# Altium schematic sheet MCU.SchDoc: MCU
size A3; Date: 9/24/2014; Author: P.A.; CompanyName: STMicroelectronics; Organization: Microcontrollers Division; Address1: 12, Rue Jules HOROWITZ; Address2: 38019 Grenoble; Address3: FRANCE; DocumentNumber: MB1189; Revision: B-07; SheetNumber: 2; SheetTotal: 12; Project: STM32F469I-DISCO
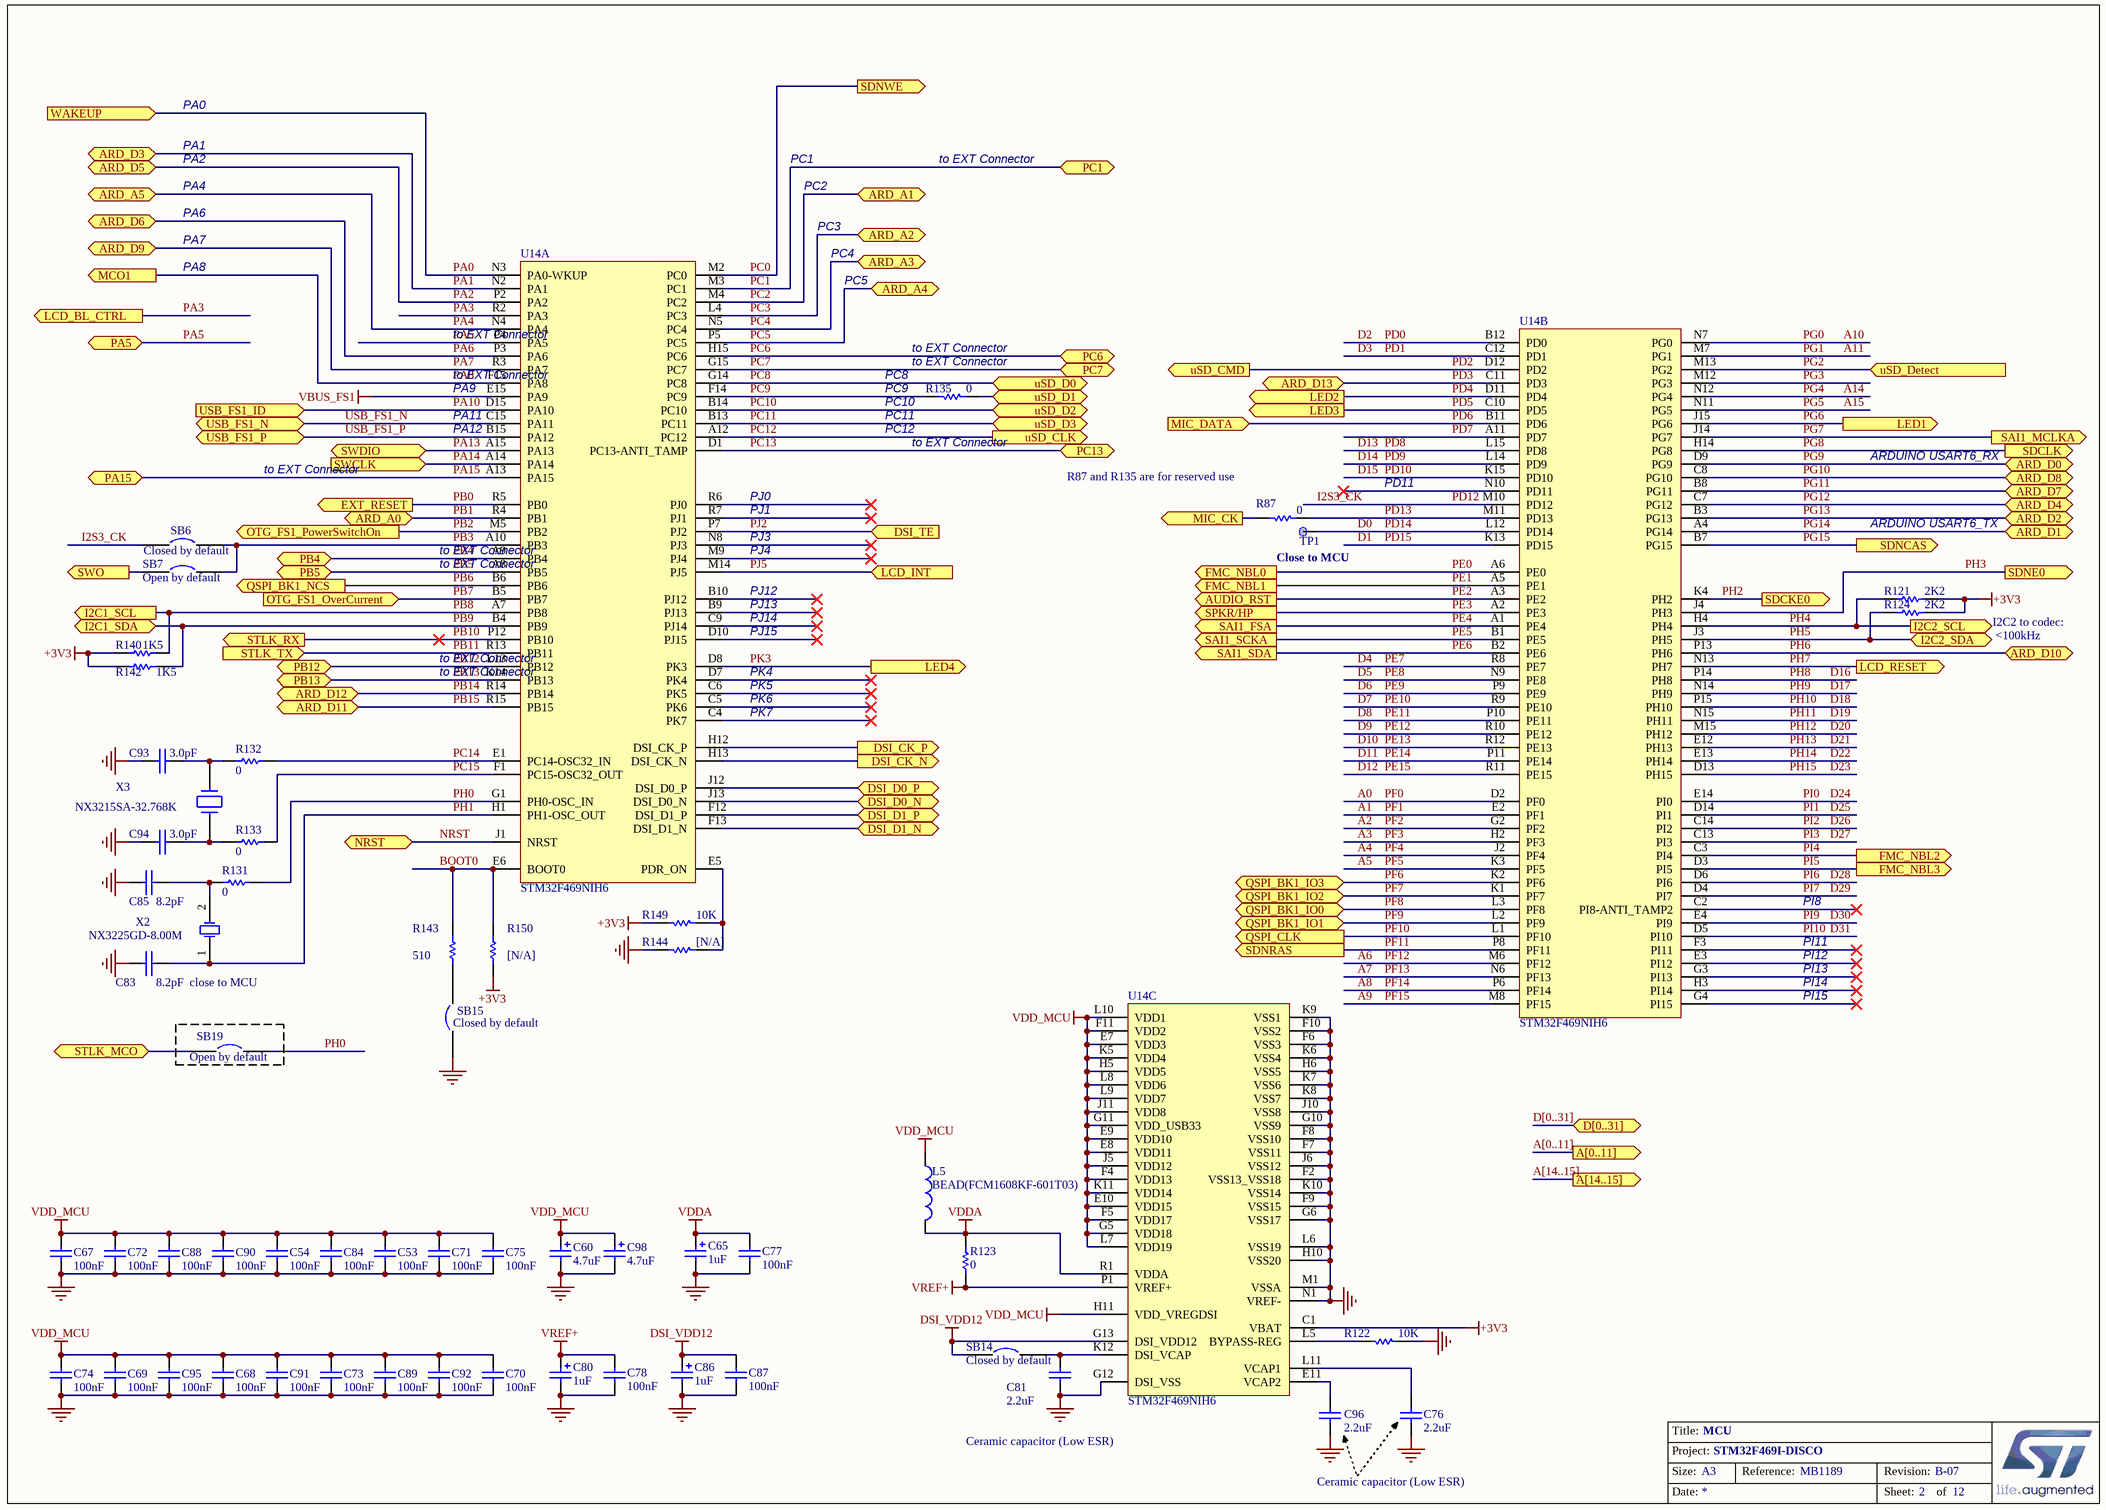
[diagram p0: MCU.SchDoc]

## Parts
C53  100nF  [0402C]
C54  100nF  [0402C]
C60  4.7uF  [TAN-A]
C65  1uF  [TAN-A]
C67  100nF  [0402C]
C68  100nF  [0402C]
C69  100nF  [0402C]
C70  100nF  [0402C]
C71  100nF  [0402C]
C72  100nF  [0402C]
C73  100nF  [0402C]
C74  100nF  [0402C]
C75  100nF  [0402C]
C76  2.2uF  [1206C]
C77  100nF  [0402C]
C78  100nF  [0402C]
C80  1uF  [TAN-A]
C81  2.2uF  [1206C]
C83  8.2pF  [0603C]
C84  100nF  [0402C]
C85  8.2pF  [0603C]
C86  1uF  [TAN-A]
C87  100nF  [0402C]
C88  100nF  [0402C]
C89  100nF  [0402C]
C90  100nF  [0402C]
C91  100nF  [0402C]
C92  100nF  [0402C]
C93  3.0pF  [0603C]
C94  3.0pF  [0603C]
C95  100nF  [0402C]
C96  2.2uF  [1206C]
C98  4.7uF  [TAN-A]
L5  BEAD(FCM1608KF-601T03)  [0603L]
R87  0  [0603R]
R121  2K2  [0603R]
R122  10K  [0402R]
R123  0  [0603R]
R124  2K2  [0603R]
R131  0  [0603R]
R132  0  [0603R]
R133  0  [0603R]
R135  0  [0603R]
R140  1K5  [0603R]
R142  1K5  [0603R]
R143  510  [0603R]
R144  [N/A]  [0603R]
R149  10K  [0402R]
R150  [N/A]  [0603R]
SB6  Closed by default  [SB_0603]
SB7  Open by default  [SB_0603]
SB14  Closed by default  [SB_0603]
SB15  Closed by default  [SB_0603]
SB19  Open by default  [SB_0603]
TP1  TP  [TP_C40]  (value not drawn)
U14  STM32F469NIH6  [BGA216_0R8_13X13]  (parts A,B,C of 3)
X2  NX3225GD-8.00M  [XTAL_2SM_3R2X2R5_H1]
X3  NX3215SA-32.768K  [XTAL_2SM_3R2X1R5]

## Ports
A[0..11] (out), A[14..15] (out), ARD_A0 (bidir), ARD_A1 (bidir), ARD_A2 (bidir), ARD_A3 (bidir), ARD_A4 (bidir), ARD_A5 (bidir), ARD_D0 (bidir), ARD_D1 (bidir), ARD_D2 (bidir), ARD_D3 (bidir), ARD_D4 (bidir), ARD_D5 (bidir), ARD_D6 (bidir), ARD_D7 (bidir), ARD_D8 (bidir), ARD_D9 (bidir), ARD_D10 (bidir), ARD_D11 (bidir), ARD_D12 (bidir), ARD_D13 (bidir), AUDIO_RST (out), D[0..31] (bidir), DSI_CK_N (out), DSI_CK_P (out), DSI_D0_N (bidir), DSI_D0_P (bidir), DSI_D1_N (bidir), DSI_D1_P (bidir), DSI_TE (in), EXT_RESET (out), FMC_NBL0 (out), FMC_NBL1 (out), FMC_NBL2 (out), FMC_NBL3 (out), I2C1_SCL (out), I2C1_SDA (bidir), I2C2_SCL (out), I2C2_SDA (bidir), LCD_BL_CTRL (out), LCD_INT (in), LCD_RESET (out), LED1 (out), LED2 (out), LED3 (out), LED4 (out), MCO1 (out), MIC_CK (out), MIC_DATA (in), NRST (bidir), OTG_FS1_OverCurrent (in), OTG_FS1_PowerSwitchOn (out), PA5 (bidir), PA15 (bidir), PB4 (bidir), PB5 (bidir), PB12 (bidir), PB13 (bidir), PC1 (bidir), PC6 (bidir), PC7 (bidir), PC13 (bidir), QSPI_BK1_IO0 (bidir), QSPI_BK1_IO1 (bidir), QSPI_BK1_IO2 (bidir), QSPI_BK1_IO3 (bidir), QSPI_BK1_NCS (out), QSPI_CLK (out), SAI1_FSA (out), SAI1_MCLKA (out), SAI1_SCKA (out), SAI1_SDA (out), SDCKE0 (out), SDCLK (out), SDNCAS (out), SDNE0 (out), SDNRAS (out), SDNWE (out), SPKR/HP (out), STLK_MCO, STLK_RX (out), STLK_TX (in), SWCLK (in), SWDIO, SWO (out), USB_FS1_ID (in), USB_FS1_N (bidir), USB_FS1_P (bidir), uSD_CLK (out), uSD_CMD (out), uSD_D0 (bidir), uSD_D1 (bidir), uSD_D2 (bidir), uSD_D3 (bidir), uSD_Detect (in), WAKEUP (in)

## Nets
+3V3: R121.1 R124.1 R140.1 R142.1 R149.2 R150.2 U14.C1(VBAT)
DSI_VDD12: C86.1 C87.2 SB14.1 U14.G13(DSI_VDD12)
GND: C53.2 C54.2 C60.2 C65.2 C67.2 C68.2 C69.2 C70.2 C71.2 C72.2 C73.2 C74.2 C75.2 C76.2 C77.1 C78.1 C80.2 C81.2 C83.2 C84.2 C85.2 C86.2 C87.1 C88.2 C89.2 C90.2 C91.2 C92.2 C93.2 C94.2 C95.2 C96.2 C98.2 R122.1 R144.2 SB15.1 U14.F2(VSS13_VSS18) U14.F6(VSS3) U14.F7(VSS11) U14.F8(VSS10) U14.F9(VSS15) U14.F10(VSS2) U14.G6(VSS17) U14.G10(VSS9) U14.G12(DSI_VSS) U14.H6(VSS5) U14.H10(VSS20) U14.J6(VSS12) U14.J10(VSS8) U14.K6(VSS4) U14.K7(VSS6) U14.K8(VSS7) U14.K9(VSS1) U14.K10(VSS14) U14.L6(VSS19) U14.M1(VSSA) U14.N1(VREF-)
VBUS_FS1: U14.E15(PA9)
VDD_MCU: C53.1 C54.1 C60.1 C67.1 C68.1 C69.1 C70.1 C71.1 C72.1 C73.1 C74.1 C75.1 C84.1 C88.1 C89.1 C90.1 C91.1 C92.1 C95.1 C98.1 L5.1 U14.E7(VDD3) U14.E8(VDD11) U14.E9(VDD10) U14.E10(VDD15) U14.F4(VDD13) U14.F5(VDD17) U14.F11(VDD2) U14.G5(VDD18) U14.G11(VDD_USB33) U14.H5(VDD5) U14.H11(VDD_VREGDSI) U14.J5(VDD12) U14.J11(VDD8) U14.K5(VDD4) U14.K11(VDD14) U14.L7(VDD19) U14.L8(VDD6) U14.L9(VDD7) U14.L10(VDD1)
VDDA: C65.1 C77.2 L5.2 R123.1 U14.R1(VDDA)
VREF+: C78.2 C80.1 R123.2 U14.P1(VREF+)
A0: U14.D2(PF0)  [also labelled PF0]
A1: U14.E2(PF1)  [also labelled PF1]
A2: U14.G2(PF2)  [also labelled PF2]
A3: U14.H2(PF3)  [also labelled PF3]
A4: U14.J2(PF4)  [also labelled PF4]
A5: U14.K3(PF5)  [also labelled PF5]
A6: U14.M6(PF12)  [also labelled PF12]
A7: U14.N6(PF13)  [also labelled PF13]
A8: U14.P6(PF14)  [also labelled PF14]
A9: U14.M8(PF15)  [also labelled PF15]
A10: U14.N7(PG0)  [also labelled PG0]
A11: U14.M7(PG1)  [also labelled PG1]
A14: U14.N12(PG4)  [also labelled PG4]
A15: U14.N11(PG5)  [also labelled PG5]
BOOT0: R143.1 R150.1 U14.E6(BOOT0)
D0: TP1.1 U14.L12(PD14)  [also labelled PD14]
D1: U14.K13(PD15)  [also labelled PD15]
D2: U14.B12(PD0)  [also labelled PD0]
D3: U14.C12(PD1)  [also labelled PD1]
D4: U14.R8(PE7)  [also labelled PE7]
D5: U14.N9(PE8)  [also labelled PE8]
D6: U14.P9(PE9)  [also labelled PE9]
D7: U14.R9(PE10)  [also labelled PE10]
D8: U14.P10(PE11)  [also labelled PE11]
D9: U14.R10(PE12)  [also labelled PE12]
D10: U14.R12(PE13)  [also labelled PE13]
D11: U14.P11(PE14)  [also labelled PE14]
D12: U14.R11(PE15)  [also labelled PE15]
D13: U14.L15(PD8)  [also labelled PD8]
D14: U14.L14(PD9)  [also labelled PD9]
D15: U14.K15(PD10)  [also labelled PD10]
D16: U14.P14(PH8)  [also labelled PH8]
D17: U14.N14(PH9)  [also labelled PH9]
D18: U14.P15(PH10)  [also labelled PH10]
D19: U14.N15(PH11)  [also labelled PH11]
D20: U14.M15(PH12)  [also labelled PH12]
D21: U14.E12(PH13)  [also labelled PH13]
D22: U14.E13(PH14)  [also labelled PH14]
D23: U14.D13(PH15)  [also labelled PH15]
D24: U14.E14(PI0)  [also labelled PI0]
D25: U14.D14(PI1)  [also labelled PI1]
D26: U14.C14(PI2)  [also labelled PI2]
D27: U14.C13(PI3)  [also labelled PI3]
D28: U14.D6(PI6)  [also labelled PI6]
D29: U14.D4(PI7)  [also labelled PI7]
D30: U14.E4(PI9)  [also labelled PI9]
D31: U14.D5(PI10)  [also labelled PI10]
DSI_CK_N: U14.H13(DSI_CK_N) ; port DSI_CK_N
DSI_CK_P: U14.H12(DSI_CK_P) ; port DSI_CK_P
DSI_D0_N: U14.J13(DSI_D0_N) ; port DSI_D0_N
DSI_D0_P: U14.J12(DSI_D0_P) ; port DSI_D0_P
DSI_D1_N: U14.F13(DSI_D1_N) ; port DSI_D1_N
DSI_D1_P: U14.F12(DSI_D1_P) ; port DSI_D1_P
I2S3_CK: SB6.1 U14.M10(PD12)  [also labelled PD12]
MIC_CK: R87.1 ; port MIC_CK
NRST: U14.J1(NRST) ; port NRST
PA0: U14.N3(PA0-WKUP) ; port WAKEUP
PA1: U14.N2(PA1) ; port ARD_D3
PA2: U14.P2(PA2) ; port ARD_D5
PA3: U14.R2(PA3) ; port LCD_BL_CTRL
PA4: U14.N4(PA4) ; port ARD_A5
PA5: U14.P4(PA5) ; port PA5
PA6: U14.P3(PA6) ; port ARD_D6
PA7: U14.R3(PA7) ; port ARD_D9
PA8: U14.F15(PA8) ; port MCO1
PA10: U14.D15(PA10) ; port USB_FS1_ID
PA13: U14.A15(PA13) ; port SWDIO
PA14: U14.A14(PA14) ; port SWCLK
PA15: U14.A13(PA15) ; port PA15
PB0: U14.R5(PB0) ; port EXT_RESET
PB1: U14.R4(PB1) ; port ARD_A0
PB2: U14.M5(PB2) ; port OTG_FS1_PowerSwitchOn
PB3: SB6.2 SB7.2 U14.A10(PB3)
PB4: U14.A9(PB4) ; port PB4
PB5: U14.A8(PB5) ; port PB5
PB6: U14.B6(PB6) ; port QSPI_BK1_NCS
PB7: U14.B5(PB7) ; port OTG_FS1_OverCurrent
PB8: R140.2 U14.A7(PB8) ; port I2C1_SCL
PB9: R142.2 U14.B4(PB9) ; port I2C1_SDA
PB10: U14.P12(PB10) ; port STLK_RX
PB11: U14.R13(PB11) ; port STLK_TX
PB12: U14.L13(PB12) ; port PB12
PB13: U14.K14(PB13) ; port PB13
PB14: U14.R14(PB14) ; port ARD_D12
PB15: U14.R15(PB15) ; port ARD_D11
PC0: U14.M2(PC0) ; port SDNWE
PC1: U14.M3(PC1) ; port PC1
PC2: U14.M4(PC2) ; port ARD_A1
PC3: U14.L4(PC3) ; port ARD_A2
PC4: U14.N5(PC4) ; port ARD_A3
PC5: U14.P5(PC5) ; port ARD_A4
PC6: U14.H15(PC6) ; port PC6
PC7: U14.G15(PC7) ; port PC7
PC8: U14.G14(PC8) ; port uSD_D0
PC9: R135.1 U14.F14(PC9)
PC10: U14.B14(PC10) ; port uSD_D2
PC11: U14.B13(PC11) ; port uSD_D3
PC12: U14.A12(PC12) ; port uSD_CLK
PC13: U14.D1(PC13-ANTI_TAMP) ; port PC13
PC14: R132.2 U14.E1(PC14-OSC32_IN)
PC15: R133.2 U14.F1(PC15-OSC32_OUT)
PD2: U14.D12(PD2) ; port uSD_CMD
PD3: U14.C11(PD3) ; port ARD_D13
PD4: U14.D11(PD4) ; port LED2
PD5: U14.C10(PD5) ; port LED3
PD6: U14.B11(PD6) ; port MIC_DATA
PD7: U14.A11(PD7)
PD13: R87.2 U14.M11(PD13)
PE0: U14.A6(PE0) ; port FMC_NBL0
PE1: U14.A5(PE1) ; port FMC_NBL1
PE2: U14.A3(PE2) ; port AUDIO_RST
PE3: U14.A2(PE3) ; port SPKR/HP
PE4: U14.A1(PE4) ; port SAI1_FSA
PE5: U14.B1(PE5) ; port SAI1_SCKA
PE6: U14.B2(PE6) ; port SAI1_SDA
PF6: U14.K2(PF6) ; port QSPI_BK1_IO3
PF7: U14.K1(PF7) ; port QSPI_BK1_IO2
PF8: U14.L3(PF8) ; port QSPI_BK1_IO0
PF9: U14.L2(PF9) ; port QSPI_BK1_IO1
PF10: U14.L1(PF10) ; port QSPI_CLK
PF11: U14.P8(PF11) ; port SDNRAS
PG2: U14.M13(PG2) ; port uSD_Detect
PG3: U14.M12(PG3)
PG6: U14.J15(PG6) ; port LED1
PG7: U14.J14(PG7) ; port SAI1_MCLKA
PG8: U14.H14(PG8) ; port SDCLK
PG9: U14.D9(PG9) ; port ARD_D0
PG10: U14.C8(PG10) ; port ARD_D8
PG11: U14.B8(PG11) ; port ARD_D7
PG12: U14.C7(PG12) ; port ARD_D4
PG13: U14.B3(PG13) ; port ARD_D2
PG14: U14.A4(PG14) ; port ARD_D1
PG15: U14.B7(PG15) ; port SDNCAS
PH0: R131.1 SB19.2 U14.G1(PH0-OSC_IN)
PH1: C83.1 U14.H1(PH1-OSC_OUT) X2.1(OSC1)
PH2: U14.K4(PH2) ; port SDCKE0
PH3: U14.J4(PH3) ; port SDNE0
PH4: R121.2 U14.H4(PH4) ; port I2C2_SCL
PH5: R124.2 U14.J3(PH5) ; port I2C2_SDA
PH6: U14.P13(PH6) ; port ARD_D10
PH7: U14.N13(PH7) ; port LCD_RESET
PI4: U14.C3(PI4) ; port FMC_NBL2
PI5: U14.D3(PI5) ; port FMC_NBL3
PJ2: U14.P7(PJ2) ; port DSI_TE
PJ5: U14.M14(PJ5) ; port LCD_INT
PK3: U14.D8(PK3) ; port LED4
STLK_MCO: SB19.1 ; port STLK_MCO
SWO: SB7.1 ; port SWO
USB_FS1_N: U14.C15(PA11) ; port USB_FS1_N
USB_FS1_P: U14.B15(PA12) ; port USB_FS1_P
uSD_D1: R135.2 ; port uSD_D1
NetC76_1: C76.1 U14.L11(VCAP1)
NetC81_1: C81.1 SB14.2 U14.K12(DSI_VCAP)
NetC85_1: C85.1 R131.2 X2.2(OSC2)
NetC93_1: C93.1 R132.1 X3.1
NetC94_1: C94.1 R133.1 X3.2
NetC96_1: C96.1 U14.E11(VCAP2)
NetR122_2: R122.2 U14.L5(BYPASS-REG)
NetR143_2: R143.2 SB15.2
NetR144_1: R144.1 R149.1 U14.E5(PDR_ON)

Not connected (* = marked no-connect by the designer): U14 B9(PJ13)* B10(PJ12)* C2(PI8-ANTI_TAMP2)* C4(PK7)* C5(PK6)* C6(PK5)* C9(PJ14)* D7(PK4)* D10(PJ15)* E3(PI12)* F3(PI11)* G3(PI13)* G4(PI15)* H3(PI14)* M9(PJ4)* N8(PJ3)* N10(PD11)* R6(PJ0)* R7(PJ1)*

## Buses and harness runs
bus A[0..11] = port A[0..11]
bus A[14..15] = port A[14..15]
bus D[0..31] = port D[0..31]

## Notes on the sheet
- PA0
- PA1
- PA2
- PC1
- to EXT Connector
- PA6
- PA7
- PA4
- PC2
- PC3
- PA8
- PC4
- PC5
- (near R135) PC8
- (near R135) to EXT Connector
- (near U14) PA11
- (near U14) PA12
- (near U14) PA9
- (near R135) PC9
- (near R135) PC10
- (near R135) PC11
- (near R135) PC12
- PJ1
- PJ0
- (near R87) R87 and R135 are for reserved use
- PD11
- ARDUINO USART6_RX
- PJ4
- PJ3
- Close to MCU
- ARDUINO USART6_TX
- PJ15
- PJ13
- PJ12
- PJ14
- I2C2 to codec:
  <100kHz
- PK7
- PK6
- PK5
- PK4
- PI8
- close to MCU
- PI14
- PI13
- PI12
- PI11
- PI15
- Ceramic capacitor (Low ESR)
- Title:
- Project:
- Size:
- Date:
- A3
- Reference:
- Sheet:
- Revision:
- of

## Library data of the parts
C53 C54 C67-C75 C83-C85 C88-C95 = CAP: Capacitor; Ordered by: Subcon
  C53 C54 C67-C75 C84 C88-C92 C95: Published: 8-Jun-2000; Revision: July-2002: Re-released for DXP Platform.; Publisher: Altium Limited; Value: 100nF
C60 C98 = Cap Pol1: Polarized Capacitor (Radial); Value: 47uF; Ordered by: Subcon; Published: 8-Jun-2000; Revision: July-2002: Re-released for DXP Platform.; Publisher: Altium Limited
C65 C80 C86 = Cap Pol1: Polarized Capacitor (Radial); Value: 10uF; Ordered by: Subcon; Published: 8-Jun-2000; Revision: July-2002: Re-released for DXP Platform.; Publisher: Altium Limited
C76-C78 C81 C87 C96 = Cap: Capacitor; Value: 10nF; Ordered by: Subcon; Published: 8-Jun-2000; Revision: July-2002: Re-released for DXP Platform.; Publisher: Altium Limited
L5 = Inductor: Value: 100uH; Ordered by: Subcon; Published: 8-Jun-2000; Revision: July-2002: Re-released for DXP Platform.; Publisher: Altium Limited
R87 R121-R124 R131-R133 R135 R140 R142 R149 = Res1: Resistor; Value: 1K; Ordered by: Subcon; Published: 8-Jun-2000; Revision: July-2002: Re-released for DXP Platform.; Publisher: Altium Limited
R143 = res1: Resistor; Value: 1K; Ordered by: Subcon; Published: 8-Jun-2000; Revision: July-2002: Re-released for DXP Platform.; Publisher: Altium Limited
R144 = Res1: Resistor; Value: 1K; Ordered by: Subcon; Fitted: NO; Published: 8-Jun-2000; Revision: July-2002: Re-released for DXP Platform.; Publisher: Altium Limited
R150 = res1: Resistor; Value: 1K; Ordered by: Subcon; Fitted: NO; Published: 8-Jun-2000; Revision: July-2002: Re-released for DXP Platform.; Publisher: Altium Limited
SB6 SB14 SB15 = Circuit Breaker: Ordered by: Subcon; Comments: Solder bridge; Published: 24-Mar-1999; Revision: July-2002: Re-released for DXP Platform.; Publisher: Altium Limited
  SB6: ECCN_US/EU: n/a
SB7 SB19 = Circuit Breaker: Ordered by: Subcon; Comments: Solder bridge; Fitted: NO; Published: 24-Mar-1999; Revision: July-2002: Re-released for DXP Platform.; Publisher: Altium Limited
TP1 = TP: Ordered by: Subcon
U14 = Manta_Dragon_TFBGA216: Manuf_Part_1: STM32F469NIH6U cut 1.0; Ordered by: ST; Ref St: 9175177; ECCN_US/EU: 3A991A2/NEC; Manuf_1: ST
X2 = XTAL_8M_NX3225GD: Crystal 8Mhz, 8pF, -+50PPM, SMD; Manuf_1: NDK; Manuf_Part_1: NX3225GD 8MHz EXS00A-CG04874; Manuf_Part_2: NX3225GD-8.000M-STD-CRA-3; ECCN_US/EU: EAR99/NEC; NDK Ref: X3127326; Ref St: 9157029; Provided: ST; Order: NX3225GD 8MHz EXS00A-CG04874; Ordered by: ST
X3 = XTAL_32K_NX3215SA: Crystal 32.768kHz, 6pF, -+20PPM, R=50K, SMD; Manuf_1: NDK; Manuf_Part_1: NX3215SA 32.768KHz EXS00A-MU00525; Description: Crystal 32.768kHz, 6pF, -+20PPM, NDK only for ST, Type NX3215SA,  NDK Spec EXS00A-MU00525; ECCN_US/EU: EAR99/NEC; Ref St: 9157034; NDK Ref: X3101802; Provided: ST; Distrib: *; Order: NX3215SA 32.768KHz EXS00A-MU00525; Ordered by: ST